# Altium schematic sheet Main.SchDoc: Main
size A3; DrawnBy: Mogens Groth Nicolaisen; DocumentNumber: 2; SheetNumber: 2; SheetTotal: 7
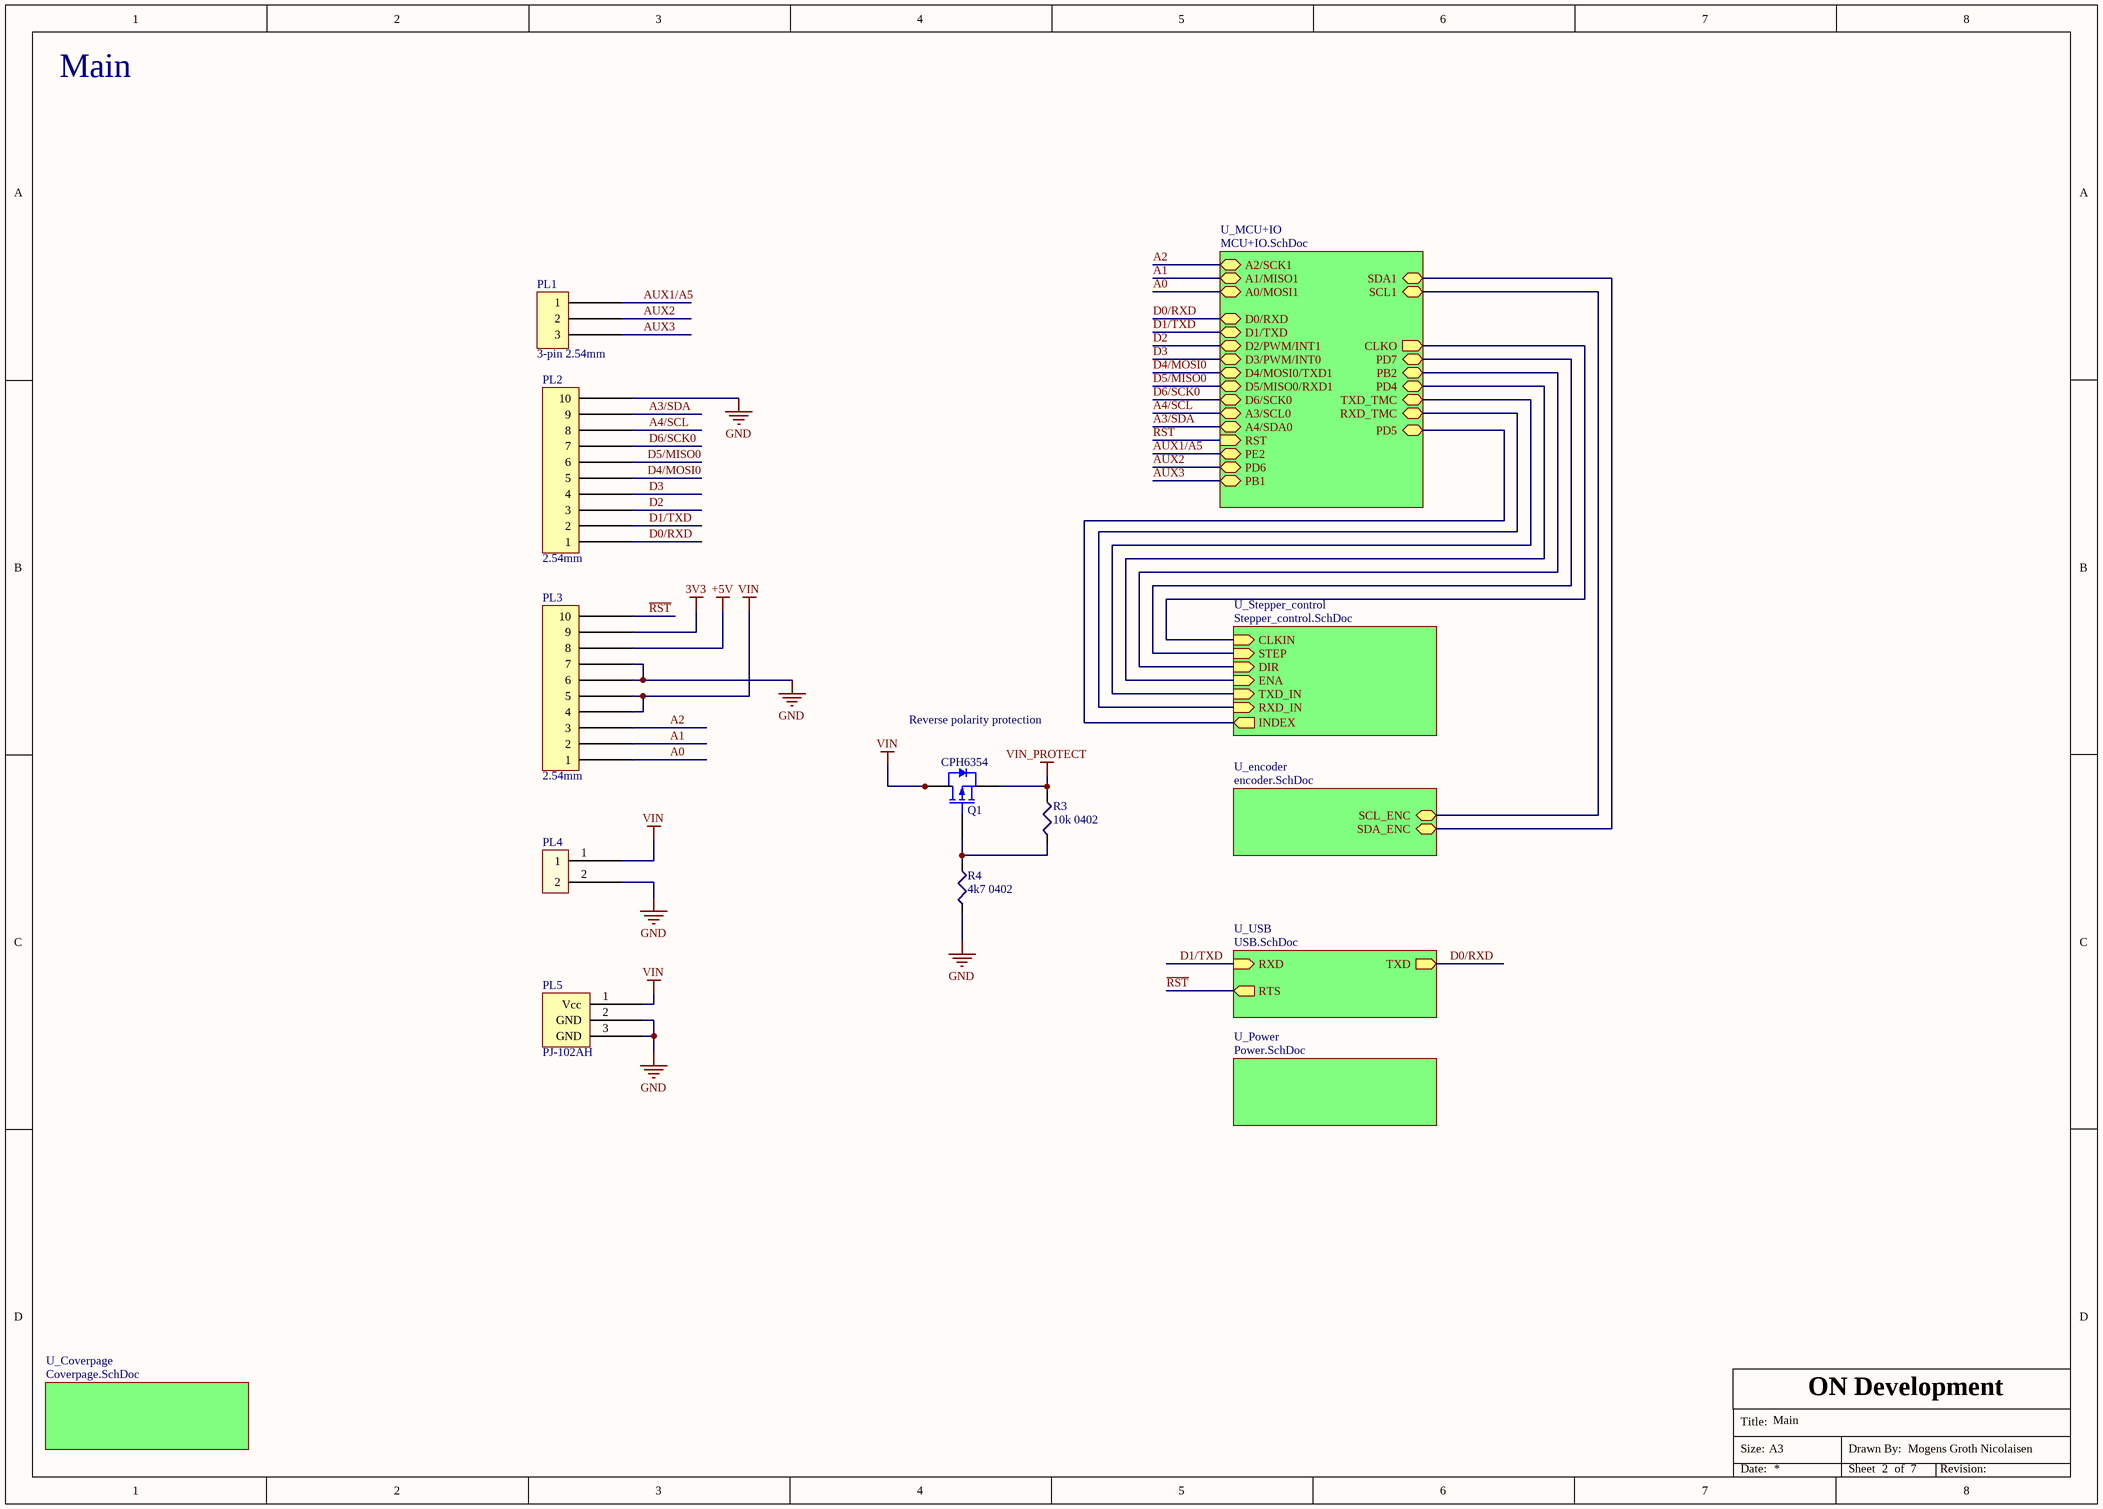
[diagram p0: Main.SchDoc]

## Parts
PL1  3-pin 2.54mm  [3-pin 2.54mm header]
PL2  2.54mm  [10-pin female 2.54mm]
PL3  2.54mm  [10-pin female 2.54mm]
PL4  2pin Terminal block 5.08mm  [5mm header]  (value not drawn)
PL5  PJ-102AH  [PJ-102AH]
Q1  CPH6354  [SOT95P280X95-6N]
R3  10k 0402  [RES_0402]
R4  4k7 0402  [RES_0402]

## Sub-sheets
U_Coverpage = Coverpage.SchDoc: no entries
U_encoder = encoder.SchDoc: SDA_ENC (bidir), SCL_ENC (bidir)
U_MCU+IO = MCU+IO.SchDoc: A2/SCK1 (bidir), A1/MISO1 (bidir), A0/MOSI1 (bidir), D1/TXD (bidir), D0/RXD (bidir), PB2 (bidir), CLKO (out), A4/SDA0 (bidir), A3/SCL0 (bidir), D3/PWM/INT0 (bidir), D2/PWM/INT1 (bidir), PD4 (bidir), PB1 (bidir), RST (in), TXD_TMC (bidir), RXD_TMC (bidir), SCL1 (bidir), D5/MISO0/RXD1 (bidir), D4/MOSI0/TXD1 (bidir), SDA1 (bidir), D6/SCK0 (bidir), PE2 (bidir), PD5 (bidir), PD6 (bidir), PD7 (bidir)
U_Power = Power.SchDoc: no entries
U_Stepper_control = Stepper_control.SchDoc: STEP (in), DIR (in), ENA (in), CLKIN (in), TXD_IN (in), RXD_IN (in), INDEX (out)
U_USB = USB.SchDoc: RXD (in), TXD (out), RTS (out)

## Nets
3V3: PL3.9
+5V: PL3.8
GND: PL2.10 PL3.6 PL3.7 PL4.2 PL5.2(GND) PL5.3(GND) R4.1
VIN: PL3.4 PL3.5 PL4.1 PL5.1(Vcc) Q1.1(DRAIN) Q1.2(DRAIN) Q1.5(DRAIN) Q1.6(DRAIN)
VIN_PROTECT: Q1.4(SOURCE) R3.2
~{RST}: PL3.10 ; sheet U_USB/RTS, sheet U_MCU+IO/RST
A0: PL3.1 ; sheet U_MCU+IO/A0/MOSI1
A1: PL3.2 ; sheet U_MCU+IO/A1/MISO1
A2: PL3.3 ; sheet U_MCU+IO/A2/SCK1
A3/SDA: PL2.9 ; sheet U_MCU+IO/A4/SDA0
A4/SCL: PL2.8 ; sheet U_MCU+IO/A3/SCL0
AUX1/A5: PL1.1 ; sheet U_MCU+IO/PE2
AUX2: PL1.2 ; sheet U_MCU+IO/PD6
AUX3: PL1.3 ; sheet U_MCU+IO/PB1
D0/RXD: PL2.1 ; sheet U_USB/TXD, sheet U_MCU+IO/D0/RXD
D1/TXD: PL2.2 ; sheet U_USB/RXD, sheet U_MCU+IO/D1/TXD
D2: PL2.3 ; sheet U_MCU+IO/D2/PWM/INT1
D3: PL2.4 ; sheet U_MCU+IO/D3/PWM/INT0
D4/MOSI0: PL2.5 ; sheet U_MCU+IO/D4/MOSI0/TXD1
D5/MISO0: PL2.6 ; sheet U_MCU+IO/D5/MISO0/RXD1
D6/SCK0: PL2.7 ; sheet U_MCU+IO/D6/SCK0
NetQ1_3: Q1.3(GATE) R3.1 R4.2
(unnamed): sheet U_MCU+IO/PB2, sheet U_Stepper_control/DIR
(unnamed): sheet U_MCU+IO/CLKO, sheet U_Stepper_control/CLKIN
(unnamed): sheet U_MCU+IO/PD4, sheet U_Stepper_control/ENA
(unnamed): sheet U_MCU+IO/TXD_TMC, sheet U_Stepper_control/TXD_IN
(unnamed): sheet U_MCU+IO/RXD_TMC, sheet U_Stepper_control/RXD_IN
(unnamed): sheet U_MCU+IO/SCL1, sheet U_encoder/SCL_ENC
(unnamed): sheet U_MCU+IO/SDA1, sheet U_encoder/SDA_ENC
(unnamed): sheet U_MCU+IO/PD5, sheet U_Stepper_control/INDEX
(unnamed): sheet U_MCU+IO/PD7, sheet U_Stepper_control/STEP

## Notes on the sheet
- Reverse polarity protection
- ON Development
- Title:
- Size:
- A3
- Drawn By:
- Date:
- Sheet
- of
- Revision:

## Library data of the parts
PL1 = CMP-003-0018-1: Pin header 3-pin 2.54mm male; Mfg. Part Number: DS1021-1*3SF1-1; DynamicData: Ningbo Connfly Electric DS1021-1*3SF1-1; Cat: Connectors; LatestRevision: 1; FootprintName1: 3-pin 2.54mm header; FootprintRevisionID1: PCC-0050-2
PL2 PL3 = CMP-003-0004-2: Pin header 10-pin 2.54mm female; Mfg. Part Number: DS1023-1*10S21
PL4 = CMP-003-0002-2: PCB terminal block, angled 90°; 5mm, 2-way, 1.5mm2; Mfg. Part Number: DG301-5.0-02P-11-00A(H)
PL5 = CMP-003-0001-3: CONN PWR JACK 2X5.5MM SOLDER; Mfg. Part Number: PJ-102AH
Q1 = CMP-014-0006-2: MOSFET P-CH 60V 4A CPH6; Mfg. Part Number: CPH6354-TL-W
R3 = CMP-001-0019-3: RES SMD 10K OHM 1% 1/16W 0402; Mfg. Part Number: RMCF0402FT10K0; Case/Package: 0402; Power: 1/16 W; Tolerance: 1 %; Value: 10k
R4 = CMP-001-0029-3: RES SMD 4.7K OHM 1% 1/16W 0402; Mfg. Part Number: RC1005F472CS; Tolerance: 1; Case/Package: 0402; Power: 1/16W; Value: 4k7